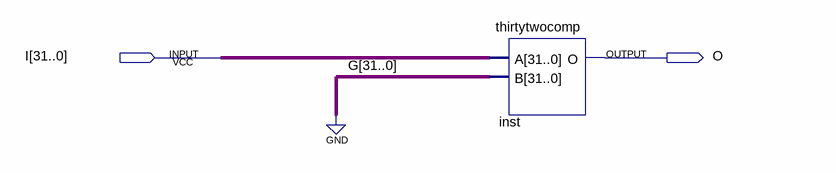
[diagram p0: schematic sheet]
// Quartus schematic testzero.bdf as structural Verilog: 1 symbols, 2 pins
module testzero (
  input  [31:0] I,
  output O
);

  thirtytwocomp inst (.A(I), .B({32{1'b0}}), .O(O));
endmodule
